# EAGLE schematic audio_amplifier (EAGLE 8.4.3)
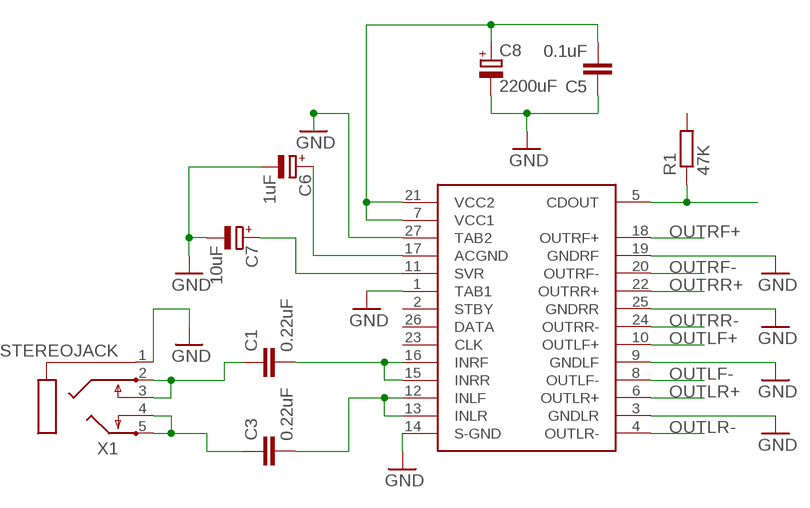
[diagram p0: schematic, sheet 1]

## Parts
C1  0.22uF  C-EU025-024X044  [C025-024X044]
C3  0.22uF  C-EU025-024X044  [C025-024X044]
C5  0.1uF  C-EU025-024X044  [C025-024X044]
C6  1uF  CPOL-EU085CS-1AR  [085CS_1AR]
C7  10uF  CPOL-EU085CS-1AR  [085CS_1AR]
C8  2200uF  CPOL-EU085CS-1AR  [085CS_1AR]
R1  47K  R-EU_0204/5  [0204/5]
TDA7563A  TDA7563A  [TDA7563]
X1  STEREOJACK  [STX3100]

## Nets
GND: C5.1 C6.- C7.- C8.- TDA7563A.1(TAB1) TDA7563A.3(GNDLR) TDA7563A.9(GNDLF) TDA7563A.14(S-GND) TDA7563A.19(GNDRF) TDA7563A.25(GNDRR) TDA7563A.27(TAB2) X1.1
N$1: C5.2 C8.+ TDA7563A.7(VCC1) TDA7563A.21(VCC2)
N$2: C7.+ TDA7563A.11(SVR)
N$3: C6.+ TDA7563A.17(ACGND)
N$4: C1.2 TDA7563A.15(INRR) TDA7563A.16(INRF)
N$5: C1.1 X1.2 X1.3
N$6: C3.1 X1.4 X1.5
N$7: C3.2 TDA7563A.12(INLF) TDA7563A.13(INLR)
N$8: R1.1 TDA7563A.5(CDOUT)
OUTLF+: TDA7563A.10(OUTLF+)
OUTLF-: TDA7563A.8(OUTLF-)
OUTLR+: TDA7563A.6(OUTLR+)
OUTLR-: TDA7563A.4(OUTLR-)
OUTRF+: TDA7563A.18(OUTRF+)
OUTRF-: TDA7563A.20(OUTRF-)
OUTRR+: TDA7563A.22(OUTRR+)
OUTRR-: TDA7563A.24(OUTRR-)
Unconnected: R1.2 TDA7563A.2(STBY) TDA7563A.23(CLK) TDA7563A.26(DATA)

## Library data of the parts
C1 C3 C5 = rcl:C-EU: CAPACITOR, European symbol
C6-C8 = rcl:CPOL-EU: POLARIZED CAPACITOR, European symbol
R1 = rcl:R-EU_: RESISTOR, European symbol
TDA7563A = tda7563a:TDA7563A: ST audio amplifier; A: ?
X1 = adafruit:STEREOJACK: MIC/HEADPHONE JACK Stereo jack with two switches. Kycon STX3100, CUI SJ1-3555NG and/or 4UCon 05544